# Altium schematic sheet Connector.SchDoc
size A4
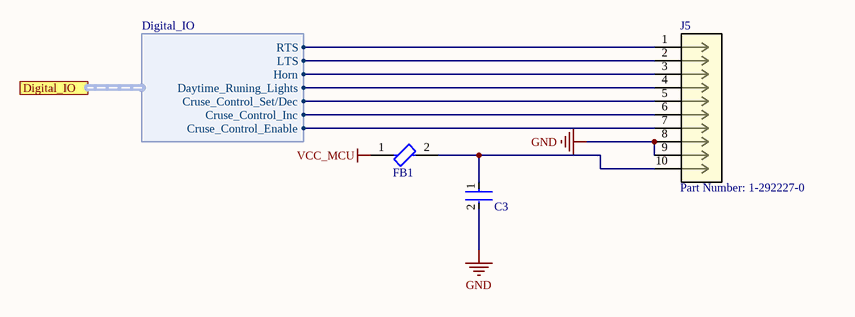
[diagram p0: Connector.SchDoc]

## Parts
C3  C0603C104K5RACTU  [Kemet_C0603_IPC_A]  (value not drawn)
FB1  2508056017Y2  [Fair-Rite_250805_0]  (value not drawn)
J5  Part Number: 1-292227-0  [CON10_1X10_DRH_H]

## Ports
Digital_IO (harness Digital_IO)

## Harnesses
Digital_IO: Cruse_Control_Enable, Cruse_Control_Inc, Cruse_Control_Set/Dec, Daytime_Runing_Lights, Horn, LTS, RTS

## Nets
GND: C3.2 J5.8 J5.9
VCC_MCU: FB1.1
NetC3_1: C3.1 FB1.2 J5.10
NetJ5_1: J5.1 ; port Digital_IO.RTS
NetJ5_2: J5.2 ; port Digital_IO.LTS
NetJ5_3: J5.3 ; port Digital_IO.Horn
NetJ5_4: J5.4 ; port Digital_IO.Daytime_Runing_Lights
NetJ5_5: J5.5 ; port Digital_IO.Cruse_Control_Set/Dec
NetJ5_6: J5.6 ; port Digital_IO.Cruse_Control_Inc
NetJ5_7: J5.7 ; port Digital_IO.Cruse_Control_Enable

## Library data of the parts
J5 = 1-292227-0: No Description Available; Vendor: TE Connectivity; Built_By: EMA_UL_Team; Manufacturer_Part_Number: 1-292227-0; Copyright: Copyright (C) 2018 Accelerated Designs. All rights reserved; RefDes: RefDes; Type: DEV; Value: Value